# Altium schematic sheet BCR.SchDoc: BLUEsat Battery Charge Regulator System
size A3; Engineer: Thomas Fisk; Organization: BLUEsat Project; DocumentNumber: POWR0008; SheetNumber: 1; SheetTotal: 1; Description: Controls charging of batteries, MPPT, provides telem data; Version: 1.0
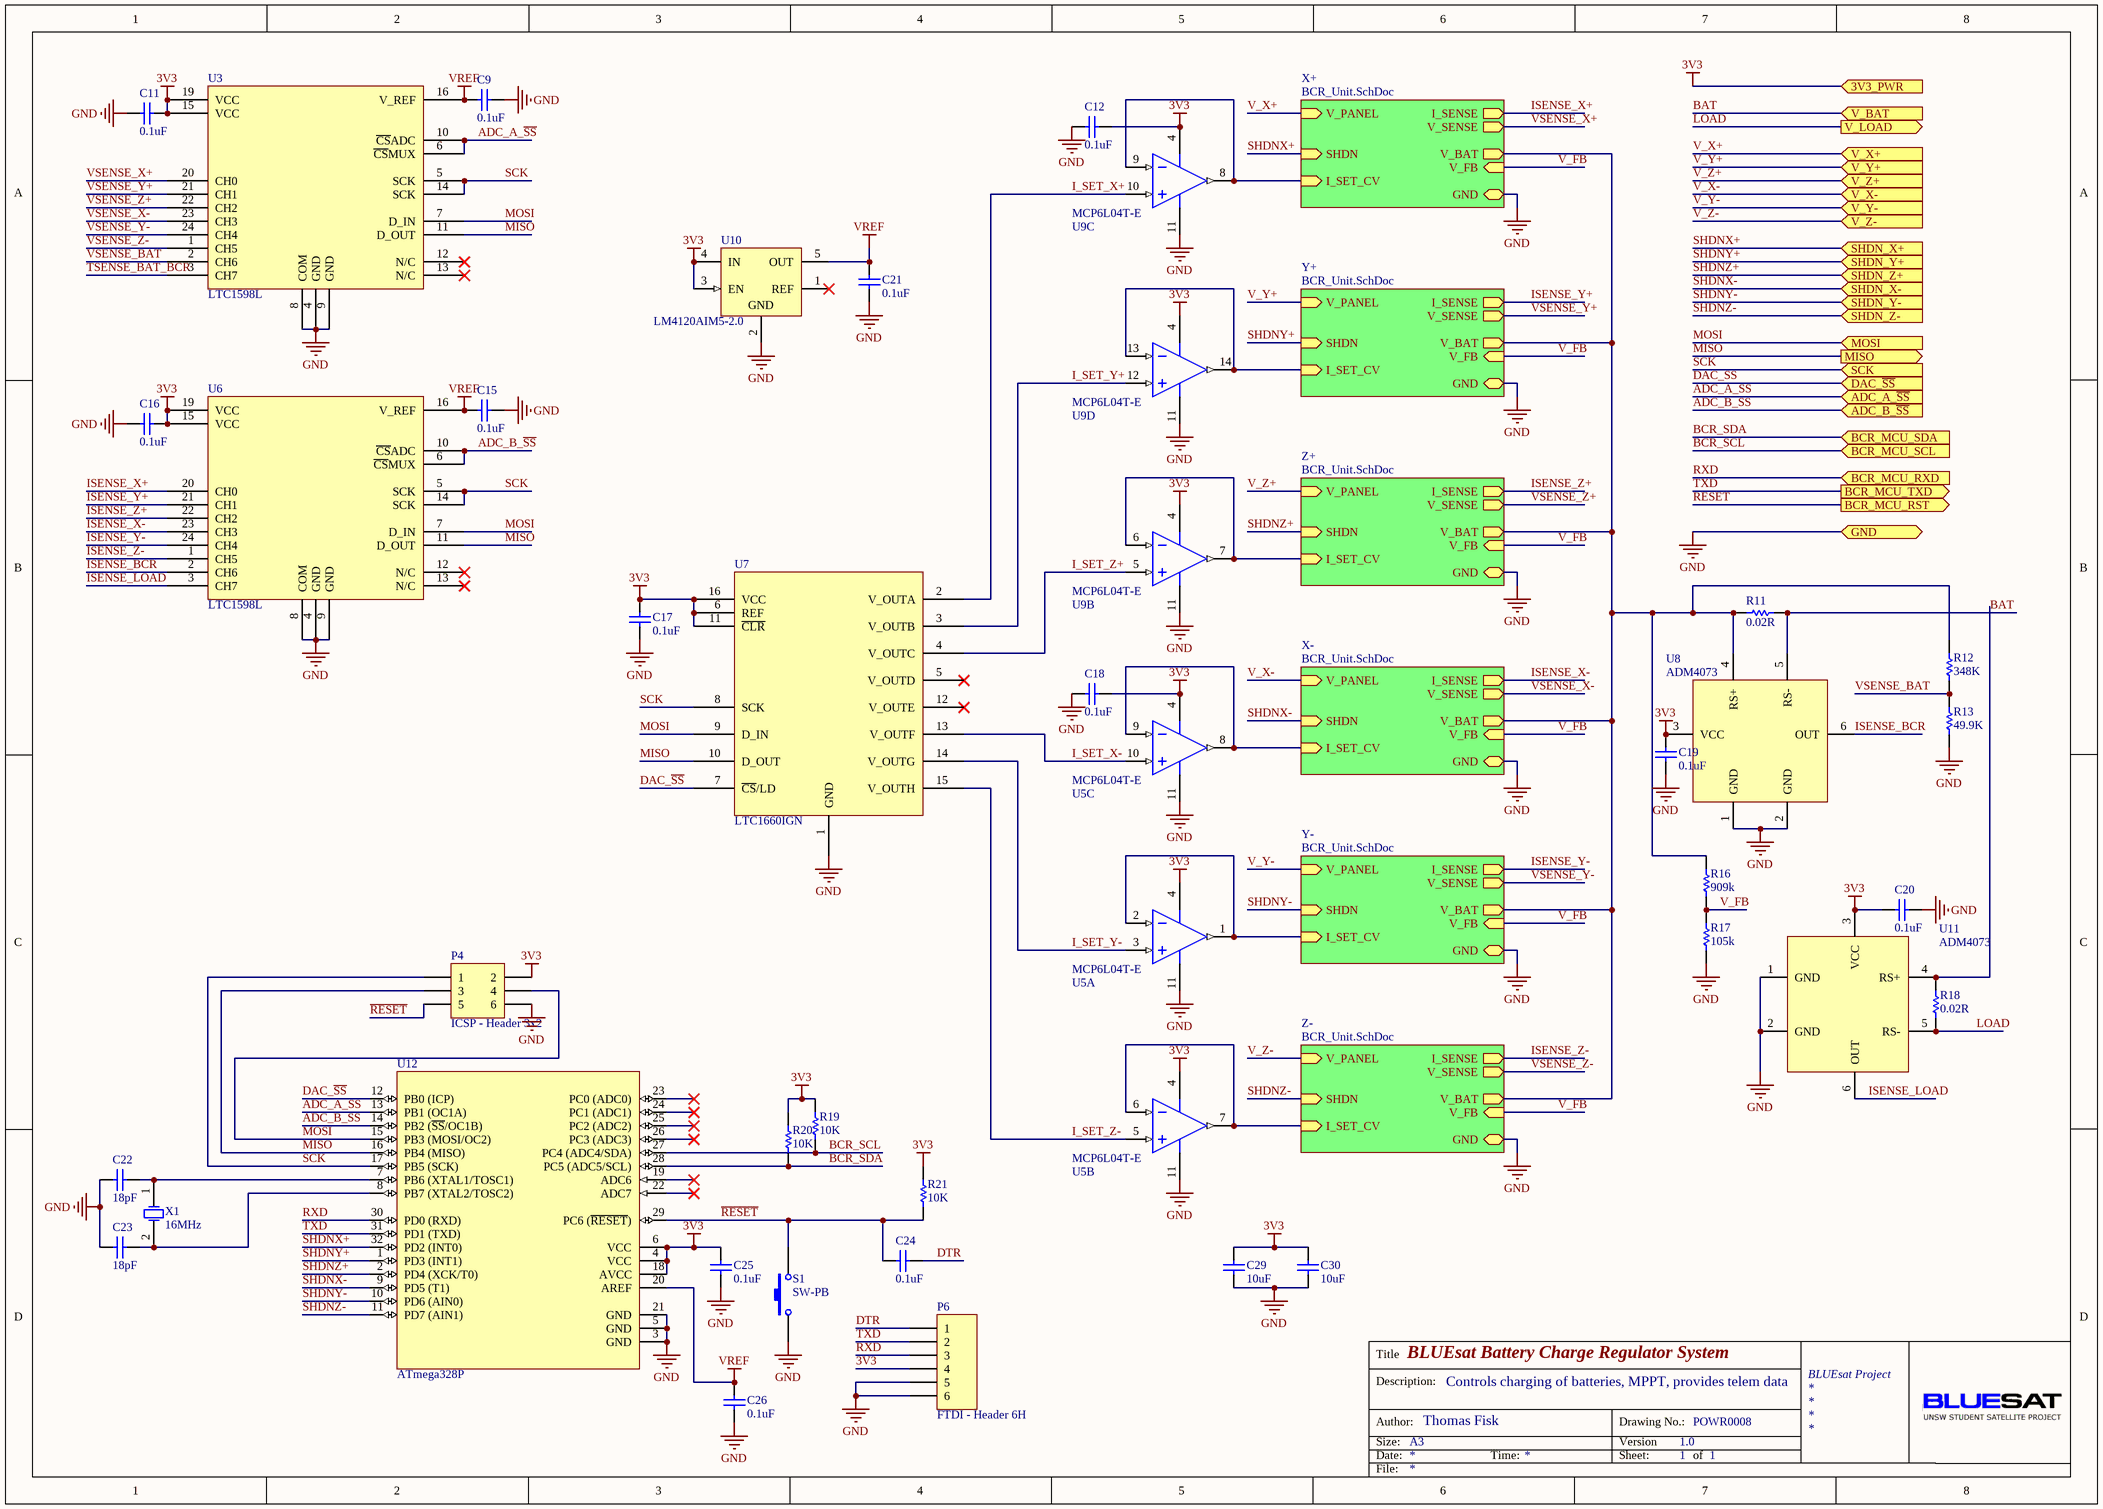
[diagram p0: BCR.SchDoc]

## Parts
C9  value 0.1uF  [CAPC2012M]  (hidden comment: Cap)
C11  value 0.1uF  [CAPC2012M]  (hidden comment: Cap)
C12  value 0.1uF  [CAPC2012M]  (hidden comment: Cap)
C15  value 0.1uF  [CAPC2012M]  (hidden comment: Cap)
C16  value 0.1uF  [CAPC2012M]  (hidden comment: Cap)
C17  value 0.1uF  [CAPC2012M]  (hidden comment: Cap)
C18  value 0.1uF  [CAPC2012M]  (hidden comment: Cap)
C19  value 0.1uF  [CAPC2012M]  (hidden comment: Cap)
C20  value 0.1uF  [CAPC2012M]  (hidden comment: Cap)
C21  value 0.1uF  [CAPC2012M]  (hidden comment: Cap)
C22  value 18pF  [CAPC2012M]  (hidden comment: Cap)
C23  value 18pF  [CAPC2012M]  (hidden comment: Cap)
C24  value 0.1uF  [CAPC2012M]  (hidden comment: Cap)
C25  value 0.1uF  [CAPC2012M]  (hidden comment: Cap)
C26  value 0.1uF  [CAPC2012M]  (hidden comment: Cap)
C29  value 10uF  [CAPC3216M]  (hidden comment: Cap)
C30  value 10uF  [CAPC3216M]  (hidden comment: Cap)
P4  ICSP - Header 3x2  [HDR2X3]
P6  FTDI - Header 6H  [HDR1X6H]
R11  value 0.02R  [RESC2012M]  (hidden comment: 0805 Resistor)
R12  value 348K  [RESC2012M]  (hidden comment: Res1)
R13  value 49.9K  [RESC2012M]  (hidden comment: Res1)
R16  value 909k  [RESC2012M]  (hidden comment: Res1)
R17  value 105k  [RESC2012M]  (hidden comment: Res1)
R18  value 0.02R  [RESC2012M]  (hidden comment: 0805 Resistor)
R19  value 10K  [RESC2012M]  (hidden comment: Res1)
R20  value 10K  [RESC2012M]  (hidden comment: Res1)
R21  value 10K  [RESC2012M]  (hidden comment: Res1)
S1  SW-PB  [RESET SWITCH]
U3  LTC1598L  [LTC1598L]
U5  MCP6L04T-E  [MTC14_N]  (parts A,B,C of 4)
U6  LTC1598L  [LTC1598L]
U7  LTC1660IGN  [LTC1660]
U8  ADM4073  [SOT95P285X145-6N]
U9  MCP6L04T-E  [MTC14_N]  (parts B,C,D of 4)
U10  LM4120AIM5-2.0  [MF05A_N]
U11  ADM4073  [SOT95P285X145-6N]
U12  ATmega328P  [32A_N]
X1  16MHz  [HC49 - No border]

## Sub-sheets
X+ = BCR_Unit.SchDoc: I_SET_CV (in), V_BAT (out), SHDN (in), V_FB (in), V_SENSE (out), I_SENSE (out), V_PANEL (in), GND
X- = BCR_Unit.SchDoc: I_SET_CV (in), V_BAT (out), SHDN (in), V_FB (in), V_SENSE (out), I_SENSE (out), V_PANEL (in), GND
Y+ = BCR_Unit.SchDoc: I_SET_CV (in), V_BAT (out), SHDN (in), V_FB (in), V_SENSE (out), I_SENSE (out), GND, V_PANEL (in)
Y- = BCR_Unit.SchDoc: I_SET_CV (in), V_BAT (out), SHDN (in), V_FB (in), V_SENSE (out), I_SENSE (out), V_PANEL (in), GND
Z+ = BCR_Unit.SchDoc: I_SET_CV (in), V_BAT (out), SHDN (in), V_FB (in), V_SENSE (out), I_SENSE (out), V_PANEL (in), GND
Z- = BCR_Unit.SchDoc: I_SET_CV (in), V_BAT (out), SHDN (in), V_FB (in), V_SENSE (out), I_SENSE (out), V_PANEL (in), GND

## Ports
3V3_PWR (in), ADC_A_~{SS} (in), ADC_B_~{SS} (in), BCR_MCU_RST (out), BCR_MCU_RXD (in), BCR_MCU_SCL (in), BCR_MCU_SDA (in), BCR_MCU_TXD (out), DAC_~{SS} (in), GND, MISO (out), MOSI (in), SCK (in), SHDN_X+ (in), SHDN_X- (in), SHDN_Y+ (in), SHDN_Y- (in), SHDN_Z+ (in), SHDN_Z- (in), V_BAT (in), V_LOAD (out), V_X+ (in), V_X- (in), V_Y+ (in), V_Y- (in), V_Z+ (in), V_Z- (in)

## Nets
3V3: C11.2 C12.2 C16.2 C17.2 C18.2 C19.1 C20.1 C25.2 C29.2 C30.2 P4.2 P6.4 R19.1 R20.1 R21.1 U3.15(VCC) U3.19(VCC) U5.4(V+) U6.15(VCC) U6.19(VCC) U7.6(REF) U7.11(~{CLR}) U7.16(VCC) U8.3(VCC) U9.4(V+) U10.3(EN) U10.4(IN) U11.3(VCC) U12.4(VCC) U12.6(VCC) U12.18(AVCC) ; port 3V3_PWR
GND: C9.1 C11.1 C12.1 C15.1 C16.1 C17.1 C18.1 C19.2 C20.2 C21.1 C22.1 C23.1 C25.1 C26.2 C29.1 C30.1 P4.6 P6.5 P6.6 R13.2 R17.1 S1.1 U3.4(GND) U3.8(COM) U3.9(GND) U5.11(V-) U6.4(GND) U6.8(COM) U6.9(GND) U7.1(GND) U8.1(GND) U8.2(GND) U9.11(V-) U10.2(GND) U11.1(GND) U11.2(GND) U12.3(GND) U12.5(GND) U12.21(GND) ; port GND, sheet X+/GND, sheet Y+/GND, sheet Z+/GND, sheet X-/GND, sheet Y-/GND, sheet Z-/GND
VREF: C9.2 C15.2 C21.2 C26.1 U3.16(V_REF) U6.16(V_REF) U10.5(OUT) U12.20(AREF)
ADC_A_~{SS}: U3.6(~{CS}MUX) U3.10(~{CS}ADC) U12.13(PB1_(OC1A)) ; port ADC_A_~{SS}
ADC_B_~{SS}: U6.6(~{CS}MUX) U6.10(~{CS}ADC) U12.14(PB2_(~{SS}/OC1B)) ; port ADC_B_~{SS}
BAT: R11.2 R18.2 U8.5(RS-) U11.4(RS+) ; port V_BAT
BCR_SCL: R19.2 U12.27(PC4_(ADC4/SDA)) ; port BCR_MCU_SCL
BCR_SDA: R20.2 U12.28(PC5_(ADC5/SCL)) ; port BCR_MCU_SDA
DAC_~{SS}: U7.7(~{CS}/LD) U12.12(PB0_(ICP)) ; port DAC_~{SS}
DTR: C24.1 P6.1
I_SET_X+: U7.2(V_OUTA) U9.10(INC+)
I_SET_X-: U5.10(INC+) U7.13(V_OUTF)
I_SET_Y+: U7.3(V_OUTB) U9.12(IND+)
I_SET_Y-: U5.3(INA+) U7.14(V_OUTG)
I_SET_Z+: U7.4(V_OUTC) U9.5(INB+)
I_SET_Z-: U5.5(INB+) U7.15(V_OUTH)
ISENSE_BCR: U6.2(CH6) U8.6(OUT)
ISENSE_LOAD: U6.3(CH7) U11.6(OUT)
ISENSE_X+: U6.20(CH0) ; sheet X+/I_SENSE
ISENSE_X-: U6.23(CH3) ; sheet X-/I_SENSE
ISENSE_Y+: U6.21(CH1) ; sheet Y+/I_SENSE
ISENSE_Y-: U6.24(CH4) ; sheet Y-/I_SENSE
ISENSE_Z+: U6.22(CH2) ; sheet Z+/I_SENSE
ISENSE_Z-: U6.1(CH5) ; sheet Z-/I_SENSE
LOAD: R18.1 U11.5(RS-) ; port V_LOAD
MISO: P4.3 U3.11(D_OUT) U6.11(D_OUT) U7.10(D_OUT) U12.16(PB4_(MISO)) ; port MISO
MOSI: P4.4 U3.7(D_IN) U6.7(D_IN) U7.9(D_IN) U12.15(PB3_(MOSI/OC2)) ; port MOSI
~{RESET}: C24.2 P4.5 R21.2 S1.2 U12.29(PC6_(~{RESET})) ; port BCR_MCU_RST
RXD: P6.3 U12.30(PD0_(RXD)) ; port BCR_MCU_RXD
SCK: P4.1 U3.5(SCK) U3.14(SCK) U6.5(SCK) U6.14(SCK) U7.8(SCK) U12.17(PB5_(SCK)) ; port SCK
SHDNX+: U12.32(PD2_(INT0)) ; port SHDN_X+, sheet X+/SHDN
SHDNX-: U12.9(PD5_(T1)) ; port SHDN_X-, sheet X-/SHDN
SHDNY+: U12.1(PD3_(INT1)) ; port SHDN_Y+, sheet Y+/SHDN
SHDNY-: U12.10(PD6_(AIN0)) ; port SHDN_Y-, sheet Y-/SHDN
SHDNZ+: U12.2(PD4_(XCK/T0)) ; port SHDN_Z+, sheet Z+/SHDN
SHDNZ-: U12.11(PD7_(AIN1)) ; port SHDN_Z-, sheet Z-/SHDN
TSENSE_BAT_BCR: U3.3(CH7)
TXD: P6.2 U12.31(PD1_(TXD)) ; port BCR_MCU_TXD
V_FB: R16.1 R17.2 ; sheet X+/V_FB, sheet Y+/V_FB, sheet Z+/V_FB, sheet X-/V_FB, sheet Y-/V_FB, sheet Z-/V_FB
V_X+: port V_X+, sheet X+/V_PANEL
V_X-: port V_X-, sheet X-/V_PANEL
V_Y+: port V_Y+, sheet Y+/V_PANEL
V_Y-: port V_Y-, sheet Y-/V_PANEL
V_Z+: port V_Z+, sheet Z+/V_PANEL
V_Z-: port V_Z-, sheet Z-/V_PANEL
VSENSE_BAT: R12.2 R13.1 U3.2(CH6)
VSENSE_X+: U3.20(CH0) ; sheet X+/V_SENSE
VSENSE_X-: U3.23(CH3) ; sheet X-/V_SENSE
VSENSE_Y+: U3.21(CH1) ; sheet Y+/V_SENSE
VSENSE_Y-: U3.24(CH4) ; sheet Y-/V_SENSE
VSENSE_Z+: U3.22(CH2) ; sheet Z+/V_SENSE
VSENSE_Z-: U3.1(CH5) ; sheet Z-/V_SENSE
NetC22_2: C22.2 U12.7(PB6_(XTAL1/TOSC1)) X1.1(OSC1)
NetC23_2: C23.2 U12.8(PB7_(XTAL2/TOSC2)) X1.2(OSC2)
NetR11_1: R11.1 R12.1 R16.2 U8.4(RS+) ; sheet X+/V_BAT, sheet Y+/V_BAT, sheet Z+/V_BAT, sheet X-/V_BAT, sheet Y-/V_BAT, sheet Z-/V_BAT
NetU5_1: U5.1(OUTA) U5.2(INA-) ; sheet Y-/I_SET_CV
NetU5_6: U5.6(INB-) U5.7(OUTB) ; sheet Z-/I_SET_CV
NetU5_8: U5.8(OUTC) U5.9(INC-) ; sheet X-/I_SET_CV
NetU9_6: U9.6(INB-) U9.7(OUTB) ; sheet Z+/I_SET_CV
NetU9_8: U9.8(OUTC) U9.9(INC-) ; sheet X+/I_SET_CV
NetU9_13: U9.13(IND-) U9.14(OUTD) ; sheet Y+/I_SET_CV

Not connected (* = marked no-connect by the designer): U3 12(N/C)* 13(N/C)*; U6 12(N/C)* 13(N/C)*; U7 5(V_OUTD)* 12(V_OUTE)*; U10 1(REF)*; U12 19(ADC6)* 22(ADC7)* 23(PC0_(ADC0))* 24(PC1_(ADC1))* 25(PC2_(ADC2))* 26(PC3_(ADC3))*

## Notes on the sheet
- Title
- Description:
- Size:
- Author:
- Date:
- A3
- Time:
- Version
- Sheet:
- Drawing No.:
- of
- File:

## Library data of the parts
C9 C11 C12 C15-C26 C29 C30 = Cap: Capacitor; Published: 8-Jun-2000; LatestRevisionDate: 17-Jul-2002; LatestRevisionNote: Re-released for DXP Platform.; PackageReference: RAD-0.3; Publisher: Altium Limited; PackageDescription: Radial Cap, Thru-Hole; 2 Leads; 0.3 in Pin Spacing; Supplier 1: Farnell; Supplier 2: Farnell; Supplier Part Number 2: 1759265
P4 = Header 3X2: Header, 3-Pin, Dual row; LatestRevisionDate: 17-Jul-2002; LatestRevisionNote: Re-released for DXP Platform.; Publisher: Altium Limited
P6 = Header 6H: Header, 6-Pin, Right Angle; LatestRevisionDate: 17-Jul-2002; LatestRevisionNote: Re-released for DXP Platform.; Publisher: Altium Limited
R11-R13 R16-R21 = Res1: Resistor; Published: 8-Jun-2000; LatestRevisionDate: 17-Jul-2002; LatestRevisionNote: Re-released for DXP Platform.; PackageReference: AXIAL-0.3; Publisher: Altium Limited; PackageDescription: Axial Device, Thru-Hole; 2 Leads; 0.3 in Pin Spacing; Supplier 1: Farnell
S1 = SW-PB: Switch; Published: 24-Mar-1999; LatestRevisionDate: 17-Jul-2002; LatestRevisionNote: Re-released for DXP Platform.; PackageReference: SPST-2; Publisher: Altium Limited; PackageDescription: Switch; 2 Leads
U5 U9 = LMV554MT: 3 MHz, Micropower RRO Amplifier; Manufacturer: National Semiconductor; CompType: Amplifiers; PackageTopMarking: NSUZXYTT*LMV55*4MT; PowerWise: Y; Published: 4-Dec-2008; LatestRevisionDate: 13-Jan-2009; LatestRevisionNote: Sim Model Added.; DatasheetVersion: Aug-2008; PackageVersion: revD, Jun-2003; PackageReference: MTC14; Publisher: Altium Limited; PackageDescription: Molded TSSOP, JEDEC, 5 x 4.4 x 0.9mm Body, 14 Lead, 0.65mm Pitch; PartNumber: LMV554MT; RoHS: Y; PinCount: 14; DigiKeyPartNumber: LMV554MT-ND; Code_JEDEC: MO-153-AB-1; ComponentLink1Description: LMV554 Datasheet; ComponentLink1URL: http://www.national.com/ds/LM/LMV554.pdf; ComponentLink2Description: LMV554 Web Page; ComponentLink2URL: http://www.national.com/pf/LM/LMV554.html; ComponentLink3Description: MTC14 Package Page; ComponentLink3URL: http://www.national.com/packaging/folders/mtc14.html
U8 U11 = ADM4073: Current Sense Amplifer
U10 = LM4120AIM5-2.0: Precision Micropower Low Dropout Voltage Reference; Manufacturer: National Semiconductor; CompType: Voltage Reference IC; PackageTopMarking: R14A*XTT; PowerWise: Y; Published: 4-Dec-2008; DatasheetVersion: Mar-2005; PackageVersion: revD, Aug-2008; PackageReference: MF05A; Publisher: Altium Limited; PackageDescription: Molded SOT-23, .115 x .063 x .040 in Body, 5 Lead, .0375 in Pitch; PartNumber: LM4120AIM5-2.0; RoHS: O; PinCount: 5; DigiKeyPartNumber: LM4120AIM5-2.0CT-ND; ComponentLink1Description: LM4120 Datasheet; ComponentLink1URL: http://www.national.com/ds/LM/LM4120.pdf; ComponentLink2Description: LM4120 Web Page; ComponentLink2URL: http://www.national.com/pf/LM/LM4120.html; ComponentLink3Description: MF05A Package Page; ComponentLink3URL: http://www.national.com/packaging/folders/mf05a.html
U12 = ATmega8-16AC: 8-Bit AVR Microcontroller with 8K Bytes of In-System Programmable Flash Memory; Published: 17-Sep-2003; LatestRevisionDate: 13-Apr-2006; LatestRevisionNote: IPC-7351 Footprint Added.; DatasheetVersion: 2486H-AVR-09/02; PackageVersion: revB, Oct-2001; PackageReference: 32A; Publisher: Altium Limited; PackageDescription: 32-Pin Thin Quad Flat Pack 0.8 mm Pitch; Code_JEDEC: MS-026-ABA; ComponentLink1Description: Manufacturer Link; ComponentLink1URL: http://www.atmel.com; ComponentLink2Description: Datasheet; ComponentLink2URL: http://www.atmel.com/dyn/resources/prod_documents/doc2486.pdf
X1 = ECS-110-S-5P: Crystal Oscillator; Published: 17-Jul-2002; DatasheetDocument: 18-Apr-2000; PackageReference: CSM-7; Publisher: Altium Limited; ComponentLink1Description: Manufacturer Link; ComponentLink1URL: http://www.ecsxtal.com/; ComponentLink2Description: Datasheet; ComponentLink2URL: http://www.ecsxtal.com/pdf3/CSM_7.pdf